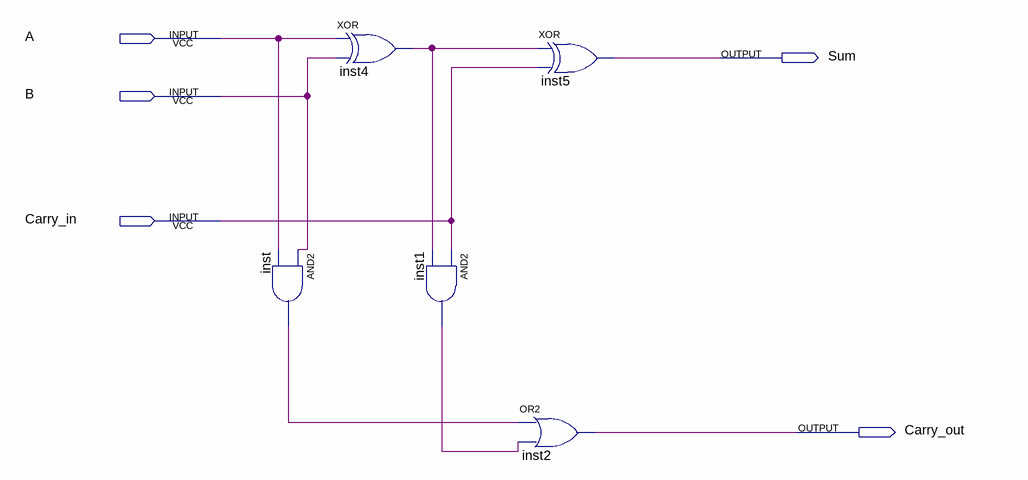
[diagram p0: schematic sheet]
// Quartus schematic somador_completo.bdf as structural Verilog: 5 symbols, 5 pins
module somador_completo (
  input  A,
  input  B,
  input  Carry_in,
  output Sum,
  output Carry_out
);

  wire inst1_out, inst4_out, inst_out;

  and inst (inst_out, B, A);
  xor inst4 (inst4_out, A, B);
  and inst1 (inst1_out, Carry_in, inst4_out);
  xor inst5 (Sum, inst4_out, Carry_in);
  or inst2 (Carry_out, inst_out, inst1_out);
endmodule
